# Altium schematic sheet top.SchDoc
size C
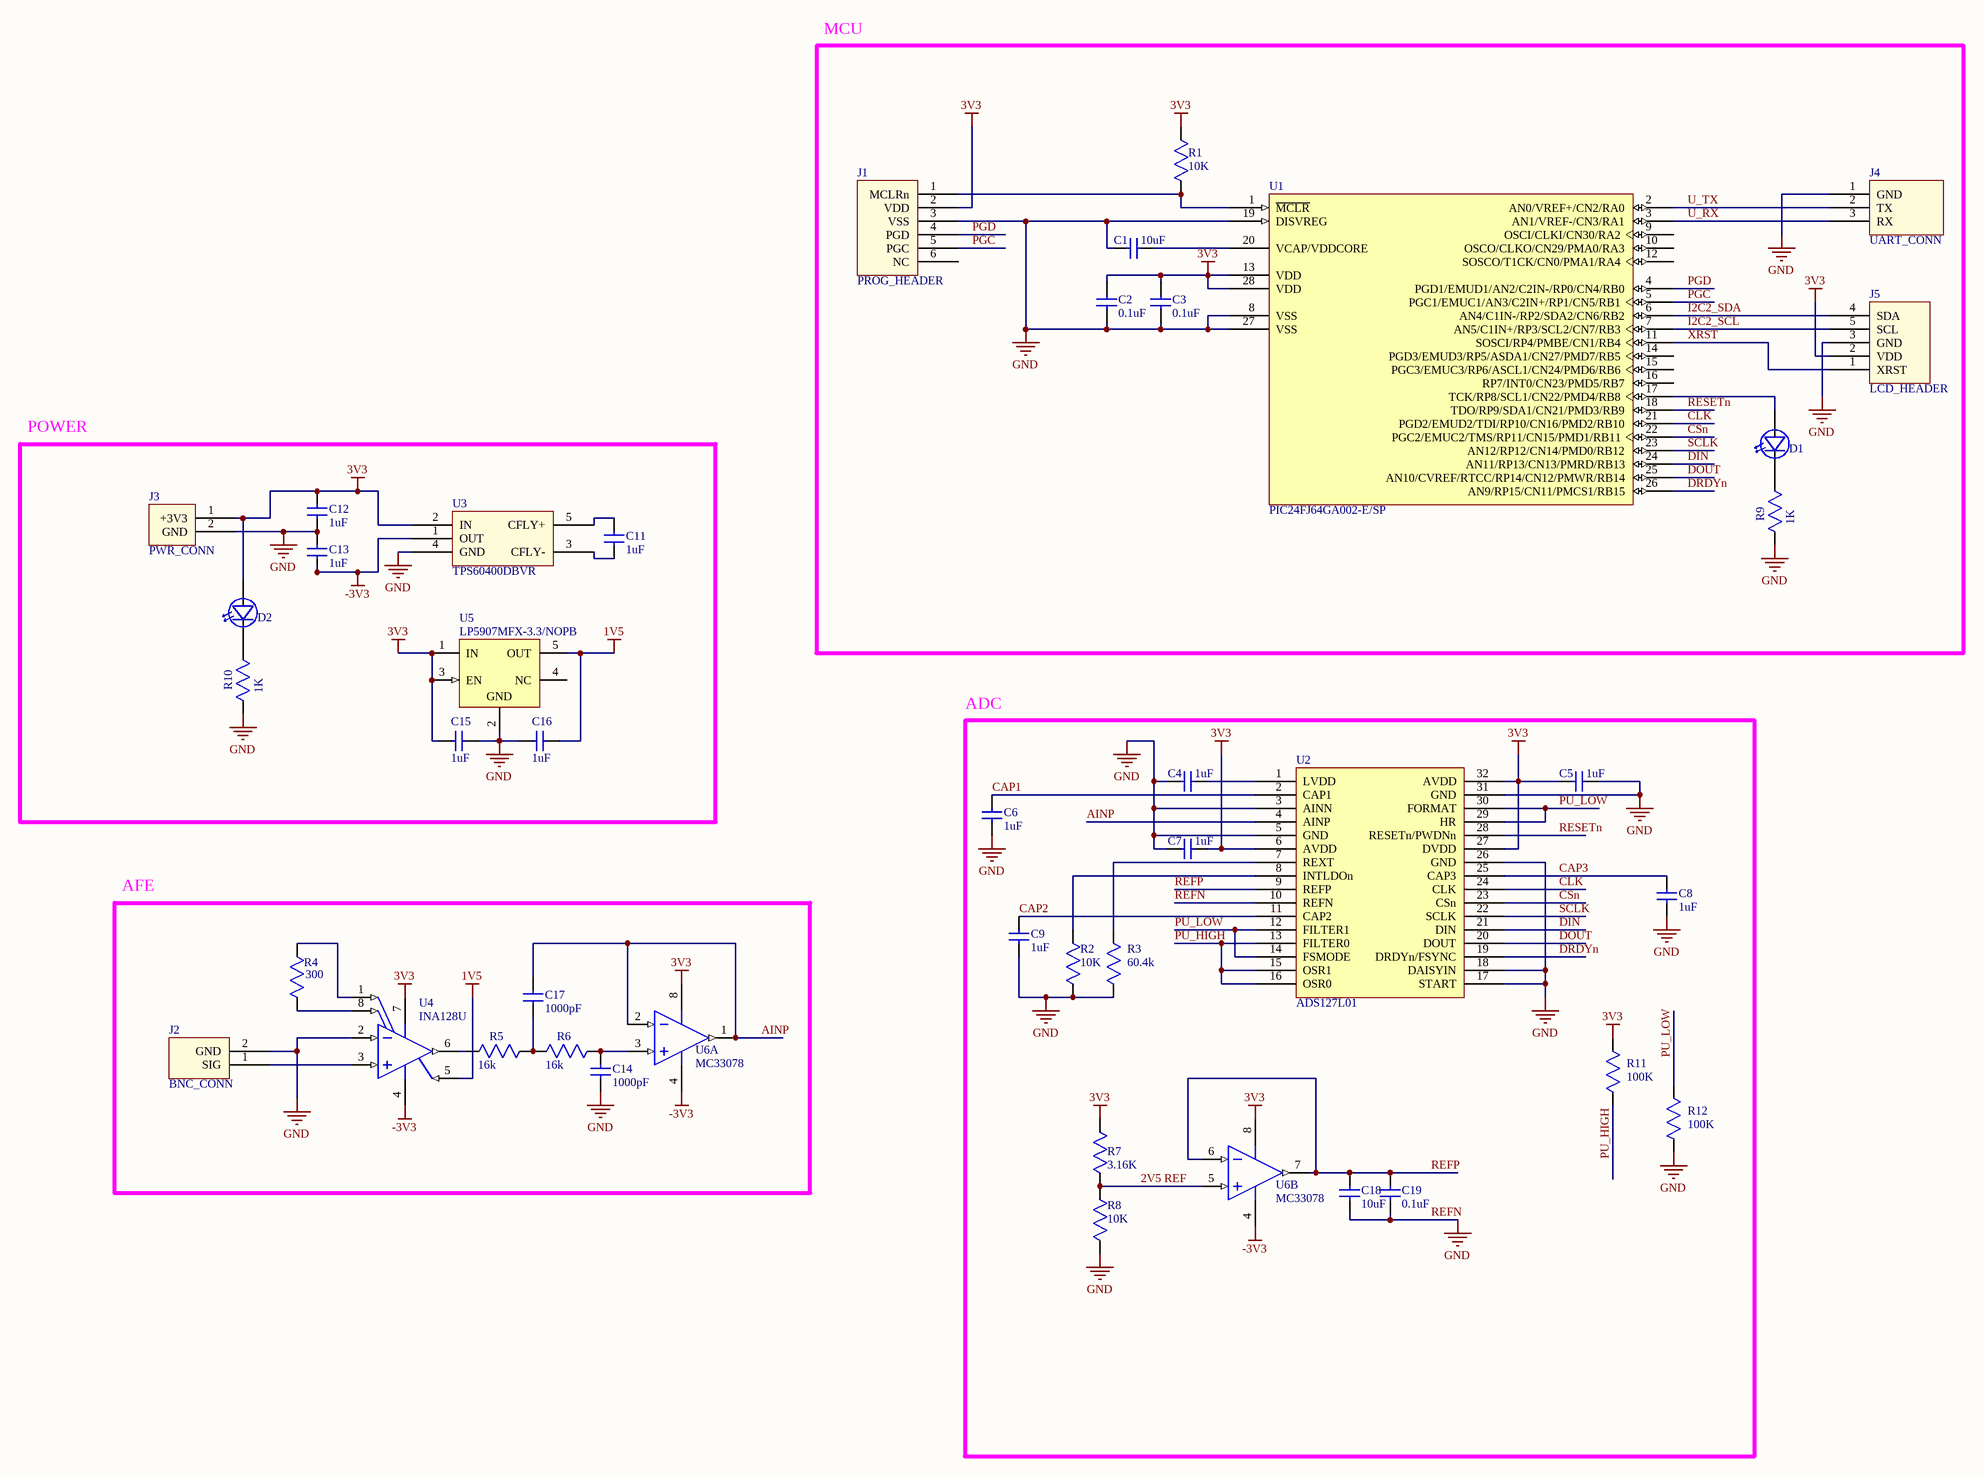
[diagram p0: top.SchDoc]

## Parts
C1  value 10uF  [1210_Capacitor]  (hidden comment: C_1210_10uF)
C2  value 0.1uF  [0805_Capacitor]  (hidden comment: CAP 0.1uF 50V X7R)
C3  value 0.1uF  [0805_Capacitor]  (hidden comment: CAP 0.1uF 50V X7R)
C4  value 1uF  [0805_Capacitor]  (hidden comment: CAP 1uF 16V X7R)
C5  value 1uF  [0805_Capacitor]  (hidden comment: CAP 1uF 16V X7R)
C6  value 1uF  [0805_Capacitor]  (hidden comment: CAP 1uF 16V X7R)
C7  value 1uF  [0805_Capacitor]  (hidden comment: CAP 1uF 16V X7R)
C8  value 1uF  [0805_Capacitor]  (hidden comment: CAP 1uF 16V X7R)
C9  value 1uF  [0805_Capacitor]  (hidden comment: CAP 1uF 16V X7R)
C11  value 1uF  [0805_Capacitor]  (hidden comment: CAP 1uF 16V X7R)
C12  value 1uF  [0805_Capacitor]  (hidden comment: CAP 1uF 16V X7R)
C13  value 1uF  [0805_Capacitor]  (hidden comment: CAP 1uF 16V X7R)
C14  value 1000pF  [0805_Capacitor]  (hidden comment: CAP 1000pF 50V X7R)
C15  value 1uF  [0805_Capacitor]  (hidden comment: CAP 1uF 16V X7R)
C16  value 1uF  [0805_Capacitor]  (hidden comment: CAP 1uF 16V X7R)
C17  value 1000pF  [0805_Capacitor]  (hidden comment: CAP 1000pF 50V X7R)
C18  value 10uF  [1210_Capacitor]  (hidden comment: C_1210_10uF)
C19  value 0.1uF  [0805_Capacitor]  (hidden comment: CAP 0.1uF 50V X7R)
D1  D_LED_0805_BLUE  [0805_BLUE]  (value not drawn)
D2  D_LED_0805_BLUE  [0805_BLUE]  (value not drawn)
J1  PROG_HEADER  [PROG_HEADER]
J2  BNC_CONN  [BNC_Connector]
J3  PWR_CONN  [PJ-063AH]
J4  UART_CONN  [UART_HEADER]
J5  LCD_HEADER  [LCD Header]
R1  value 10K  [0805_Resistor]  (hidden comment: R_0805_10K_1%)
R2  value 10K  [0805_Resistor]  (hidden comment: R_0805_10K_1%)
R3  value 60.4k  [0805_Resistor]  (hidden comment: RES SMD 60.4K OHM 0.1% 1/8W 0805)
R4  value 300  [0805_Resistor]  (hidden comment: RES SMD 300 OHM 0.5% 1/10W 0805)
R5  value 16k  [0805_Resistor]  (hidden comment: RES SMD 16K OHM 0.5% 1/10W 0805)
R6  value 16k  [0805_Resistor]  (hidden comment: RES SMD 16K OHM 0.5% 1/10W 0805)
R7  value 3.16K  [0805_Resistor]  (hidden comment: RES SMD 3.16K OHM 1% 1/8W 0805)
R8  value 10K  [0805_Resistor]  (hidden comment: R_0805_10K_1%)
R9  value 1K  [0805_Resistor]  (hidden comment: R_0805_1K_1%)
R10  value 1K  [0805_Resistor]  (hidden comment: R_0805_1K_1%)
R11  value 100K  [0805_Resistor]  (hidden comment: R_0805_100K_1%)
R12  value 100K  [0805_Resistor]  (hidden comment: R_0805_100K_1%)
U1  PIC24FJ64GA002-E/SP  [SPDIP300-SP28]
U2  ADS127L01  [TSQFP50P700X700X105-32N]
U3  TPS60400DBVR  [TPS60400DBVR]
U4  INA128U  [D0008A_M]
U5  LP5907MFX-3.3/NOPB  [DBV0005A_L]
U6  MC33078  [8-SOIC]  (parts A,B of 2)

## Blocks framed on the sheet
MCU: C1-C3 D1 J1 J4 J5 R1 R9 U1
POWER: C11-C13 C15 C16 D2 J3 R10 U3 U5
ADC: C4-C9 C18 C19 R2 R3 R7 R8 R11 R12 U2 U6
AFE: C14 C17 J2 R4-R6 U4 U6

## Nets
1V5: C16.1 U4.5(REF) U5.5(OUT)
3V3: C2.1 C3.1 C5.1 C7.2 C12.2 C15.2 D2.2(Anode) J1.2(VDD) J3.1(+3V3) J5.2(VDD) R1.1 R7.1 R11.2 U1.13(VDD) U1.28(VDD) U2.6(AVDD) U2.27(DVDD) U2.32(AVDD) U3.2(IN) U4.7(V+) U5.1(IN) U5.3(EN) U6.8(VCC+)
-3V3: C13.1 U3.1(OUT) U4.4(V-) U6.4(VCC-)
REFN: C1.2 C2.2 C3.2 C4.1 C5.2 C6.2 C7.1 C8.2 C9.2 C12.1 C13.2 C14.2 C15.1 C16.2 C18.2 C19.2 J1.3(VSS) J2.2(GND) J3.2(GND) J4.1(GND) J5.3(GND) R2.2 R3.2 R8.2 R9.2 R10.2 R12.2 U1.8(VSS) U1.19(DISVREG) U1.27(VSS) U2.3(AINN) U2.5(GND) U2.10(REFN) U2.17(START) U2.18(DAISYIN) U2.26(GND) U2.31(GND) U3.4(GND) U4.2(VIN-) U5.2(GND)  [also labelled GND]
2V5 REF: R7.2 R8.1 U6.5(IN2+)
AINP: C17.1 U2.4(AINP) U6.1(OUT1) U6.2(IN1-)
CAP1: C6.1 U2.2(CAP1)
CAP2: C9.1 U2.11(CAP2)
CAP3: C8.1 U2.25(CAP3)
CLK: U1.21(PGD2/EMUD2/TDI/RP10/CN16/PMD2/RB10) U2.24(CLK)
CSn: U1.22(PGC2/EMUC2/TMS/RP11/CN15/PMD1/RB11) U2.23(CSn)
DIN: U1.24(AN11/RP13/CN13/PMRD/RB13) U2.21(DIN)
DOUT: U1.25(AN10/CVREF/RTCC/RP14/CN12/PMWR/RB14) U2.20(DOUT)
DRDYn: U1.26(AN9/RP15/CN11/PMCS1/RB15) U2.19(DRDYn/FSYNC)
I2C2_SCL: J5.5(SCL) U1.7(AN5/C1IN+/RP3/SCL2/CN7/RB3)
I2C2_SDA: J5.4(SDA) U1.6(AN4/C1IN-/RP2/SDA2/CN6/RB2)
PGC: J1.5(PGC) U1.5(PGC1/EMUC1/AN3/C2IN+/RP1/CN5/RB1)
PGD: J1.4(PGD) U1.4(PGD1/EMUD1/AN2/C2IN-/RP0/CN4/RB0)
PU_HIGH: R11.1 U2.13(FILTER0) U2.15(OSR1) U2.16(OSR0)
PU_LOW: R12.1 U2.12(FILTER1) U2.14(FSMODE) U2.29(HR) U2.30(FORMAT)
REFP: C18.1 C19.1 U2.9(REFP) U6.6(IN2-) U6.7(OUT2)
RESETn: U1.18(TDO/RP9/SDA1/CN21/PMD3/RB9) U2.28(RESETn/PWDNn)
SCLK: U1.23(AN12/RP12/CN14/PMD0/RB12) U2.22(SCLK)
U_RX: J4.3(RX) U1.3(AN1/VREF-/CN3/RA1)
U_TX: J4.2(TX) U1.2(AN0/VREF+/CN2/RA0)
XRST: J5.1(XRST) U1.11(SOSCI/RP4/PMBE/CN1/RB4)
NetC1_1: C1.1 U1.20(VCAP/VDDCORE)
NetC4_2: C4.2 U2.1(LVDD)
NetC11_1: C11.1 U3.3(CFLY-)
NetC11_2: C11.2 U3.5(CFLY+)
NetC14_1: C14.1 R6.1 U6.3(IN1+)
NetC17_2: C17.2 R5.1 R6.2
NetD1_1: D1.1(Cathode) R9.1
NetD1_2: D1.2(Anode) U1.17(TCK/RP8/SCL1/CN22/PMD4/RB8)
NetD2_1: D2.1(Cathode) R10.1
NetJ1_1: J1.1(MCLRn) R1.2 U1.1(~{MCLR})
NetJ2_1: J2.1(SIG) U4.3(VIN+)
NetR2_1: R2.1 U2.8(INTLDOn)
NetR3_1: R3.1 U2.7(REXT)
NetR4_1: R4.1 U4.1(RG)
NetR4_2: R4.2 U4.8(RG)
NetR5_2: R5.2 U4.6(VO)

Not connected (* = marked no-connect by the designer): J1 6(NC); U1 9(OSCI/CLKI/CN30/RA2) 10(OSCO/CLKO/CN29/PMA0/RA3) 12(SOSCO/T1CK/CN0/PMA1/RA4) 14(PGD3/EMUD3/RP5/ASDA1/CN27/PMD7/RB5) 15(PGC3/EMUC3/RP6/ASCL1/CN24/PMD6/RB6) 16(RP7/INT0/CN23/PMD5/RB7); U5 4(NC)

## Library data of the parts
C1 C18 = C_1210_10uF: CAP CER 10UF 50V 10% X5R 1210; Manufacturer: Taiyo Yuden; Manufacturer PN: UMK325BJ106KM-T; SVP Creator: Matt Rogge; Package: 1210; Supplier 1: Digi-Key; Supplier Part Number 1: 587-2247-1-ND
C2 C3 C19 = C_0805_0.1uF_50V_10%: CAP CERM 0.1uF 10% 50V 0805; SVP Creator: Spencer Berglund; Package: =SelectedPackage; Voltage: 50V; Temperature Coefficient: X7R; Supplier 1: Digi-Key; Supplier Part Number 1: 1276-1003-1-ND
C4-C9 C11-C13 C15 C16 = C_0805_1uF_16V_10%: CAP CERM 1uF 10% 16V 0805; SVP Creator: Spencer Berglund; Package: =SelectedPackage; Voltage: 16V; Temperature Coefficient: X7R; Supplier 1: Digi-Key; Supplier Part Number 1: 1276-6471-1-ND
C14 C17 = C_0805_1000pF_50V_10%: CAP CERM 1000pF 10% 50V 0805; SVP Creator: Spencer Berglund; Package: =SelectedPackage; Voltage: 50V; Temperature Coefficient: X7R; Supplier 1: Digi-Key; Supplier Part Number 1: 1276-1020-1-ND
D1 D2 = D_LED_0805_BLUE: LED 2X1.2MM 470NM BL WTR CLR SMD; Manufacturer: Kingbright; Manufacturer PN: APT2012QBC/D; SVP Creator: Jonathan Nutzmann; Current: 20mA; Forward Voltage: 3.3; Value: BLUE; Package: 0805; Supplier: Digikey; Supplier PN: 754-1437-1-ND; Supplier 1: Digi-Key; Supplier Part Number 1: 754-1437-1-ND
J1 = PROG_HEADER: For Programming the PIC24
J2 = BNC_CONN: Connector for the noise input signal; Supplier 1: Digi-Key; Supplier Part Number 1: WM5514-ND
J4 = UART_CONN: Could be either a header or a USB Connector
R1 R2 R8 = R_0805_10K_1%: RES 10K OHM 1/8W 1% 0805 SMD; Power Rating: 0.125W; SVP Creator: Spencer Berglund; Package: 0805_Resistor; Supplier 1: Digi-Key; Supplier Part Number 1: 311-10.0KCRCT-ND
R3 = R_0805_60.4K_1%: Supplier 1: Digi-Key; Supplier Part Number 1: P60.4KDACT-ND
R4 = R_0805_300_0.5%: Supplier 1: Digi-Key; Supplier Part Number 1: RR12P300DDKR-ND
R5 R6 = R_0805_16K_0.5%: Supplier 1: Digi-Key; Supplier Part Number 1: RR12P300DDKR-ND
R9 R10 = R_0805_1K_1%: RES 1K OHM 1/8W 1% 0805 SMD; Power Rating: 0.125W; SVP Creator: Spencer Berglund; Package: 0805_Resistor; Supplier 1: Digi-Key; Supplier Part Number 1: 311-1.00KCRCT-ND
R11 R12 = R_0805_100K_1%: RES 100K OHM 1/8W 1% 0805 SMD; Power Rating: 0.125W; SVP Creator: Spencer Berglund; Package: 0805_Resistor; Supplier 1: Digi-Key; Supplier Part Number 1: 311-100KCRCT-ND
U1 = CMP-0046-00005-1: General Purpose 16-Bit Flash Microcontroller, 64KB Flash, 8KB SRAM, 28-Pin SPDIP, Extended Temperature; PackageDescription: 28-Lead Skinny Plastic Dual In-Line (SP) - 300 mil Body [SPDIP]; PackageVersion: revBB, Aug-2009; DatasheetVersion: revD, Feb-2010; PackageReference: SPDIP300-SP28
U2 = ADS127L01: ADC; Supplier 1: Digi-Key; Supplier Part Number 1: 296-44344-6-ND
U3 = TPS60400DBVR: IC REG SWTCHD CAP INV 60MA SOT23; Supplier 1: Digi-Key; Supplier Part Number 1: 296-27004-6-ND
U4 = CMP-0992-00017-2: Precision, Low Power Instrumentation Amplifier, -40 to 85 degC, 8-pin SOIC (D8), Green (RoHS & no Sb/Br); Manufacturer: Texas Instruments; Gain(V/V): 1 to 10000; Noise at 1kHz(Typ)(nV/rt(Hz)): 8; Number of Channels: 1; Vs(Max)(V): 36; Vs(Min)(V): 4.5; Input Offset (+/-)(Max)(uV): 50; Input Bias Current (+/-)(Max)(nA): 5; Non-Linearity (+/-)(Max)(%): 0.002; CMRR(Min)(dB): 120; Input Offset Drift (+/-)(Max)(uV/Degrees Celsius): 0.5; SubFamily: Dual Supply; Quiescent Current (+/-)(Typ)(mA): 0.7; ComponentLink1URL: http://www.ti.com/; PackageVersion: 4040047-3/M, 06/2011; PackageDescription: 8-Pin Plastic Small Outline, Body 4.9 x 3.9 mm, Pitch 1.27 mm; Mounting Technology: Surface Mount; ComponentLink3URL: http://www.ti.com/litv/pdf/msoi002j; ComponentLink3Description: Package Specification; PackageReference: D0008A; PartNumber: INA128U; Code_JEDEC: MS-012; ComponentLink2Description: Datasheet; Eco-Plan: Green (RoHS & no Sb/Br); DatasheetVersion: SBOS051B; ComponentLink2URL: http://www.ti.com/general/docs/lit/getliterature.tsp?genericPartNumber=INA128&fileType=pdf; ComponentLink1Description: Manufacturer URL
U5 = CMP-2000-07464-1: Ultra-Low-Noise, Low-IQ LDO, 0.25 A, Fixed 3.3 V Output, 2.2 to 5.5 V Input, -40 to 125 degC, 5-Pin SOT-23 (DBV), Green (RoHS & no Sb/Br), Tape and Reel; Manufacturer: Texas Instruments; Max Output Current: 250mA; Max Input Voltage: 5.5V; Dropout Voltage: 250mV; Number of Regulators: 1; Nominal Output Voltage: 3.3V; Output Voltage Accuracy: 2%; Polarity: Positive; Min Input Voltage: 2.2V; Package Version: 4073253-4/N, 12/2014; Quiescent Current: 425uA; Power Supply Rejection Ratio (PSRR): 82dB; Case\/Package: SOT-23; Lead Free: LeadFree; Package Reference: DBV5; Output Current: 250mA; Package Description: 5-Pin Small Outline Transistor, Body 2.9 x 1.6 mm, Pitch 0.95 mm; Max Operating Temperature: 125degC; Mounting Technology: SurfaceMount; Number of Pins: 5; Mount: SurfaceMount; Manufacturer URL: http://www.ti.com/; Accuracy: 2%; Package URL: http://www.ti.com/lit/ml/mpds018l/mpds018l.pdf; Output Voltage: 3.3V; Radiation Hardening: No; Number of Outputs: 1; Packaging: TapeandReel; RoHSCompliant: true; Min Operating Temperature: -40degC; Datasheet URL: http://www.ti.com/lit/ds/symlink/lp5907.pdf; Package Quantity: 3000; Datasheet Version: Rev. L, 09/2016; REACH SVHC: NoSVHC; Contact Plating: Tin
R7 = RES SMD 3.16K OHM 1% 1/8W 0805: Supplier 1: Digi-Key; Supplier Part Number 1: P3.16KCDKR-ND